# EAGLE design Mini Radio Station (EAGLE 9.6.2)
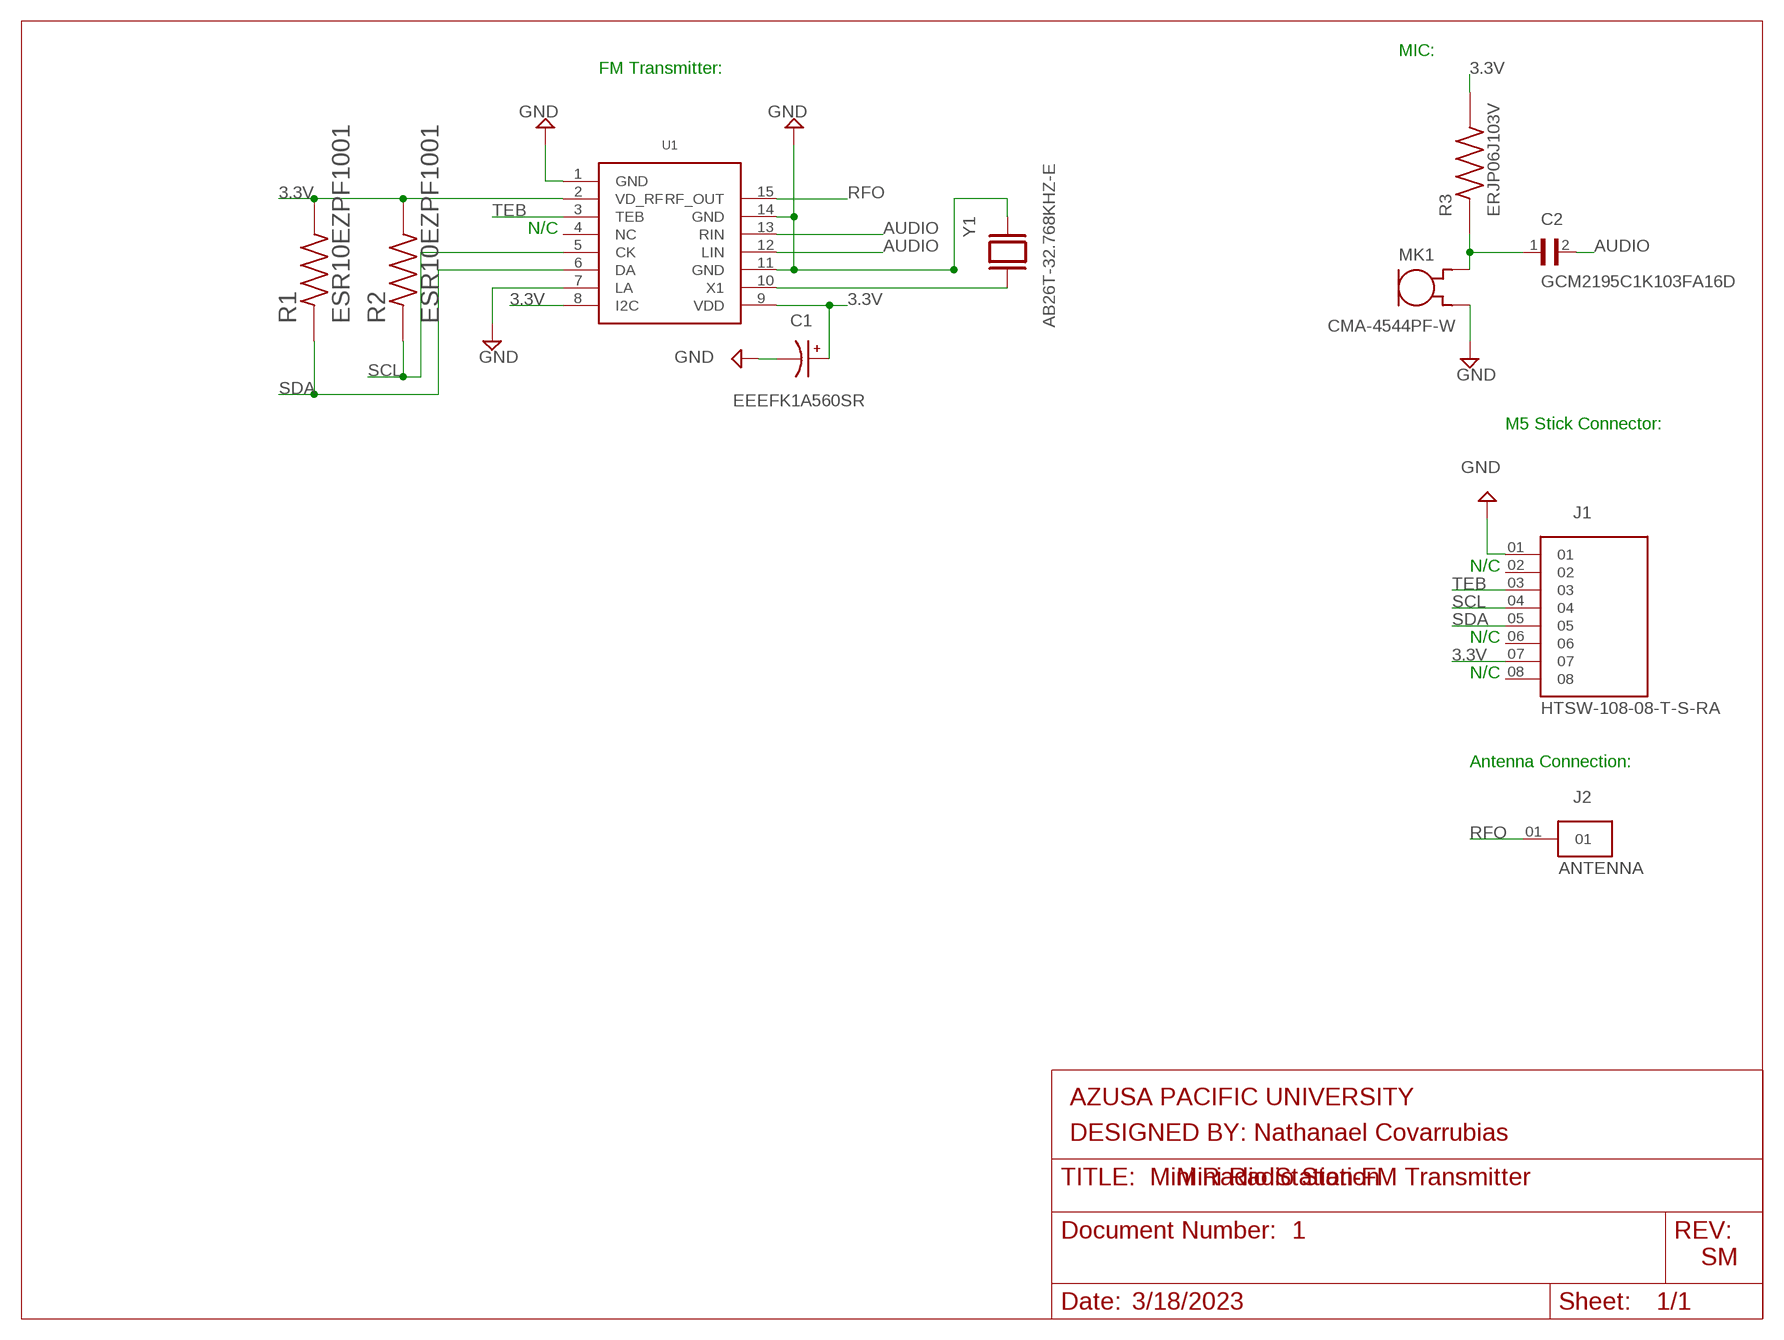
[diagram p0: schematic, sheet 1]

## Parts
C1  EEEFK1A560SR  [CAP_EEEFK1A560SR]
C2  GCM2195C1K103FA16D  [CAPC2012X95N]
J1  HTSW-108-08-T-S-RA  [SAMTEC_HTSW-108-08-T-S-RA]
J2  ANTENNA  [ANTENNA]
MK1  CMA-4544PF-W  [MIC_CMA-4544PF-W]
R1  ESR10EZPF1001  [RESC2012X65N]
R2  ESR10EZPF1001  [RESC2012X65N]
R3  ERJP06J103V  [RES_ERJP06J103V]
U1  NS73M  [NS73M]
Y1  AB26T-32.768KHZ-E  [XTAL_AB26T-32.768KHZ-E]

## Nets
3.3V: C1.1 J1.07 R1.2 R2.2 R3.2 U1.2(VD_RF) U1.8(I2C) U1.9(VDD)
AUDIO: C2.2 U1.12(LIN) U1.13(RIN)
GND: C1.2 J1.01 MK1.2(GND) U1.1(GND) U1.7(LA) U1.11(GND) U1.14(GND) Y1.1
N$1: U1.10(X1) Y1.2
N$2: C2.1 MK1.1(OUT) R3.1
RFO: J2.01 U1.15(RF_OUT)
SCL: J1.04 R2.1 U1.5(CK)
SDA: J1.05 R1.1 U1.6(DA)
TEB: J1.03 U1.3(TEB)
Unconnected: J1.02 J1.06 J1.08 U1.4(NC)

## Notes on the sheet
- MIC:
- FM Transmitter:
- N/C
- M5 Stick Connector:
- N/C
- N/C
- N/C
- Antenna Connection:
- AZUSA PACIFIC UNIVERSITY
- DESIGNED BY: Nathanael Covarrubias
- Mini Radio Station-FM Transmitter
- 1
- SM
- 3/18/2023

## Library data of the parts
C1 = FM Transmitter-M5 Stick C Plus edition:EEEFK1A560SR: Check availability <https://pricing.snapeda.com/parts/EEE-FK1A560SR/Panasonic%20Electronic%20Components/view-part?ref=eda>; AVAILABILITY: In Stock; DESCRIPTION: CAP ALUM 56UF 20% 10V SMD; MF: Panasonic Electronic Components; MP: EEE-FK1A560SR; PACKAGE: RADIAL-2 Panasonic; PRICE: None; PURCHASE-URL: https://pricing.snapeda.com/search/part/EEE-FK1A560SR/?ref=eda
C2 = FM Transmitter-M5 Stick C Plus edition:GCM2195C1K103FA16D: SMD Capacitor C0G(EIA) with Capacitance: 10000pF Tol. 1%. Rated Voltage: 80Vdc Check availability <https://pricing.snapeda.com/parts/GCM2195C1K103FA16D/Murata/view-part?ref=eda>; AVAILABILITY: In Stock; DESCRIPTION: SMD capacitor C0G(EIA) with capacitance 10000pF Tol.1%. Rated voltage 80Vdc 125C; MF: Murata; MP: GCM2195C1K103FA16D; PACKAGE: 2012 Murata; PRICE: None; PURCHASE-URL: https://pricing.snapeda.com/search/part/GCM2195C1K103FA16D/?ref=eda
J1 = FM Transmitter-M5 Stick C Plus edition:HTSW-108-08-T-S-RA; MANUFACTURER: Samtec; PARTREV: R; STANDARD: Manufacturer Recommendations
J2 = FM Transmitter-M5 Stick C Plus edition:ANTENNA
MK1 = FM Transmitter-M5 Stick C Plus edition:CMA-4544PF-W: CMA Series 9.7 mm Electret Condenser Omni-Directional Pin Mount 3 V Microphone Check availability <https://pricing.snapeda.com/parts/CMA-4544PF-W/CUI%20Devices/view-part?ref=eda>; AVAILABILITY: In Stock; CUI_PURCHASE_URL: https://www.cuidevices.com/product/audio/microphones/electret-condenser-microphones/cma-4544pf-w?utm_source=snapeda.com&utm_medium=referral&utm_campaign=snapedaBOM; DESCRIPTION: 9.7 mm, Omnidirectional, PCB Mount, 3.0 Vdc, Electret Condenser Microphone; MF: CUI Devices; MP: CMA-4544PF-W; PACKAGE: None; PRICE: None; PURCHASE-URL: https://pricing.snapeda.com/search/part/CMA-4544PF-W/?ref=eda
R1 R2 = FM Transmitter-M5 Stick C Plus edition:ESR10EZPF1001: TR0805 1,00K 1% 0,4W ANTI SURGE Check availability <https://pricing.snapeda.com/parts/ESR10EZPF1001/Rohm/view-part?ref=eda>; AVAILABILITY: In Stock; DESCRIPTION: 1 kOhms ±1% 0.4W, 2/5W Chip Resistor 0805 (2012 Metric) Automotive AEC-Q200, Pulse Withstanding Thick Film; MF: Rohm; MP: ESR10EZPF1001; PACKAGE: 2012 Rohm Semiconductor; PRICE: None; PURCHASE-URL: https://pricing.snapeda.com/search/part/ESR10EZPF1001/?ref=eda
R3 = FM Transmitter-M5 Stick C Plus edition:ERJP06J103V: Check availability <https://pricing.snapeda.com/parts/ERJ-P06J103V/Panasonic%20Electronic/view-part?ref=eda>; AVAILABILITY: In Stock; DESCRIPTION: 10 kOhms ±5% 0.5W, 1/2W Chip Resistor 0805 (2012 Metric) Automotive AEC-Q200, Pulse Withstanding Thick Film; MF: Panasonic Electronic; MP: ERJ-P06J103V; PACKAGE: 2012-2 Panasonic; PRICE: None; PURCHASE-URL: https://pricing.snapeda.com/search/part/ERJ-P06J103V/?ref=eda
U1 = FM Transmitter-M5 Stick C Plus edition:NS73M
Y1 = FM Transmitter-M5 Stick C Plus edition:AB26T-32.768KHZ-E: Check availability <https://pricing.snapeda.com/parts/AB26T-32.768KHZ-E/Abracon%20LLC/view-part?ref=eda>; AVAILABILITY: In Stock; DESCRIPTION: 32.768kHz WATCH CRYSTAL, 6.2 x 02.1MM CYLINDER PACKAGE; MF: Abracon LLC; MP: AB26T-32.768KHZ-E; PACKAGE: Radial Abracon LLC; PRICE: None; PURCHASE-URL: https://pricing.snapeda.com/search/part/AB26T-32.768KHZ-E/?ref=eda

## Board
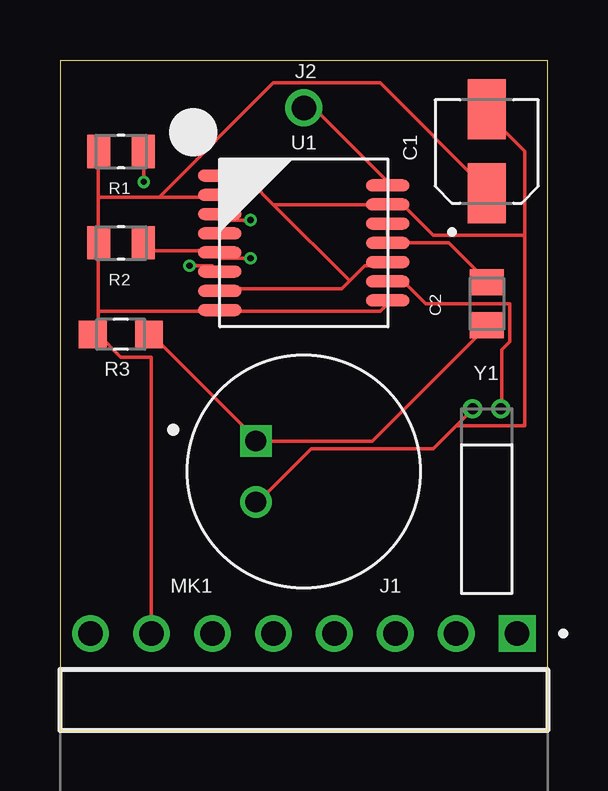
[diagram p1: board, top side]
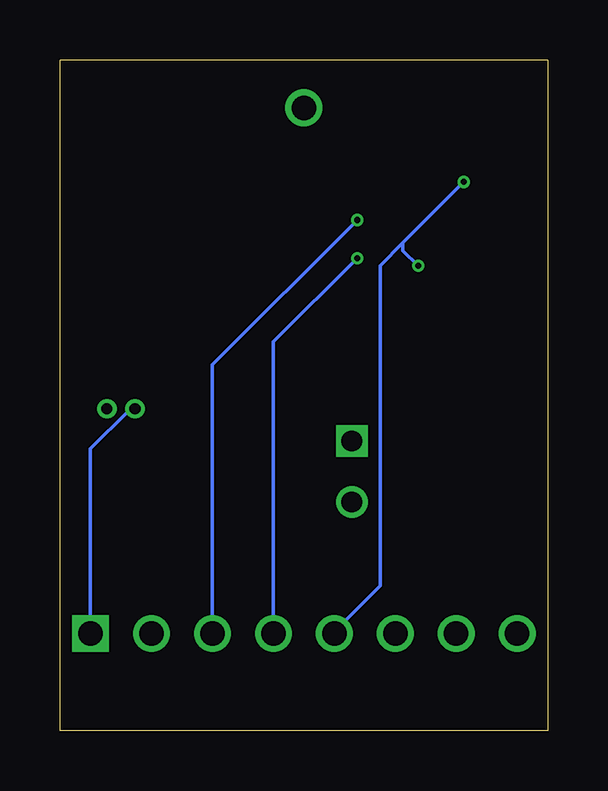
[diagram p2: board, bottom side, seen from below]

Size 20.32 x 27.94 mm. Coordinates in mm from the lower left corner, seen from the top.
Outline: 0,0 20.32,0 20.32,27.94 0,27.94 0,0
Copper layers (1*16): Top 0.035559375mm / dielectric 1.6mm / Bottom 0.035559375mm
Design rules "oshpark-2layer *": minimum track width 6mil, minimum drill 10mil, track to track 6mil, track to pad 6mil, pad to pad 6mil, via to via 6mil, smd to smd 6mil, copper to edge 15mil, drill to drill 6mil, minimum pad ring 5mil, minimum via ring 5mil, stop-mask expansion 2.5mil, vias tented up to drill 15mil, thermal gap 10mil

### Footprints (pad centres in the part's own frame; a part is rotated, then mirrored left to right if it is on the bottom)
CAP_EEEFK1A560SR = smd 2.5 x 1.6: 1 -1.75,0; 2 1.75,0
CAPC2012X95N = smd 1.08 x 1.42: 1 -0.895,0; 2 0.895,0
SAMTEC_HTSW-108-08-T-S-RA = drill 1.02 pad 1.37 square: 01 8.89,2.77 | drill 1.02 pad 1.37: 02 6.35,2.77; 03 3.81,2.77; 04 1.27,2.77; 05 -1.27,2.77; 06 -3.81,2.77; 07 -6.35,2.77; 08 -8.89,2.77
ANTENNA = drill 1.02 pad 1.37: 01 0,0.23
MIC_CMA-4544PF-W = drill 0.87 square: 1 2,-1.27 | drill 0.87: 2 2,1.27
RESC2012X65N = smd 0.97 x 1.38: 1 -0.93,0; 2 0.93,0
RES_ERJP06J103V = smd 1.15 x 1.15: 1 -1.175,0; 2 1.175,0
NS73M = smd 1.8 x 0.5: 1 -3.5,2.8; 2 -3.5,2; 3 -3.5,1.2; 4 -3.5,0.4; 5 -3.5,-0.4; 6 -3.5,-1.2; 7 -3.5,-2; 8 -3.5,-2.8; 9 3.5,-2.4; 10 3.5,-1.6; 11 3.5,-0.8; 12 3.5,0; 13 3.5,0.8; 14 3.5,1.6; 15 3.5,2.4
XTAL_AB26T-32.768KHZ-E = drill 0.46 pad 0.81: 1 0,0.585; 2 0,-0.585

### Placement (x,y rotation side)
C1  17.78,24.13 90 top
C2  17.78,17.78 90 top
J1  10.16,1.27 0 top
J2  10.16,25.72 0 top
MK1  10.16,10.79 180 top
R1  2.54,24.13 180 top
R2  2.54,20.32 180 top
R3  2.54,16.51 180 top
U1  10.16,20.32 0 top
Y1  17.78,13.41 90 top

### Tracks (layer width: path | path; a pad name or v marks a point on that pad's centre or on a via)
3.3V
  Top 0.152: 1.59,20.32 1.59,17.46 | 1.59,17.46 1.59,16.51 | 1.59,20.32 1.59,22.23 | 1.59,22.23 1.59,24.13 R1.2 | 1.59,20.32 R2.2 | 1.59,17.46 6.35,17.46 U1.8 6.67,17.46 13.34,17.46 13.65,17.78 U1.9 | 1.59,22.23 4.13,22.23 | 4.13,22.23 6.35,22.23 U1.2 | 4.13,22.23 8.89,26.99 13.34,26.99 17.78,22.54 C1.1 | J1.07 3.81,15.56 2.54,15.56 1.59,16.51 | 1.59,16.51 R3.2
AUDIO
  Top 0.152: C2.2 17.78,18.73 16.19,20.32 U1.12 13.65,20.95 U1.13
GND
  Top 0.152: 12.06,18.73 12.7,19.37 13.65,19.37 U1.11 | 12.06,18.73 11.75,18.41 6.67,18.41 U1.7 | 12.06,18.73 8.89,21.91 | 8.89,21.91 7.94,22.86 6.99,22.86 6.67,23.18 U1.1 | 8.89,21.91 13.65,21.91 U1.14 13.97,21.91 14.29,21.91 15.56,20.64 19.37,20.64 | 19.37,20.64 19.37,24.13 17.78,25.72 C1.2 | 16.51,12.7 17.14,13.34 Y1.1 | 16.51,12.7 15.56,11.75 10.48,11.75 8.26,9.53 MK1.2 | 19.37,20.64 19.37,12.7 16.51,12.7
  Bottom 0.152: J1.01 19.05,11.75 17.46,13.34 Y1.1
N$1
  Top 0.152: Y1.2 18.41,13.65 18.41,15.88 18.73,16.19 18.73,17.78 15.24,17.78 14.29,18.73 13.97,18.73 U1.10
N$2
  Top 0.152: 8.26,12.06 3.81,16.51 R3.1 | 8.26,12.06 13.02,12.06 17.78,16.83 C2.1 | 8.26,12.06 MK1.1
RFO
  Top 0.152: U1.15 13.65,22.86 10.79,25.72 10.16,25.72 J2.01
SCL  (via drill 0.25)
  Top 0.152: R2.1 3.49,20.32 3.81,20 6.35,20 U1.5 6.67,19.68 v7.94,19.68
  Bottom 0.152: v7.94,19.68 11.43,16.19 J1.04
SDA  (via drill 0.25)
  Top 0.152: v3.49,22.86 3.49,24.13 R1.1 | v5.4,19.37 6.35,19.37 U1.6
  Bottom 0.152: 6.03,20.32 6.99,19.37 6.99,6.03 8.89,4.13 J1.05 | 6.03,20.32 v3.49,22.86 | v5.4,19.37 6.03,20 6.03,20.32
TEB  (via drill 0.25)
  Top 0.152: v7.94,21.27 6.67,21.27 U1.3
  Bottom 0.152: v7.94,21.27 13.97,15.24 J1.03